# EAGLE design DC26_HHV_challenge (EAGLE 7.7.0)
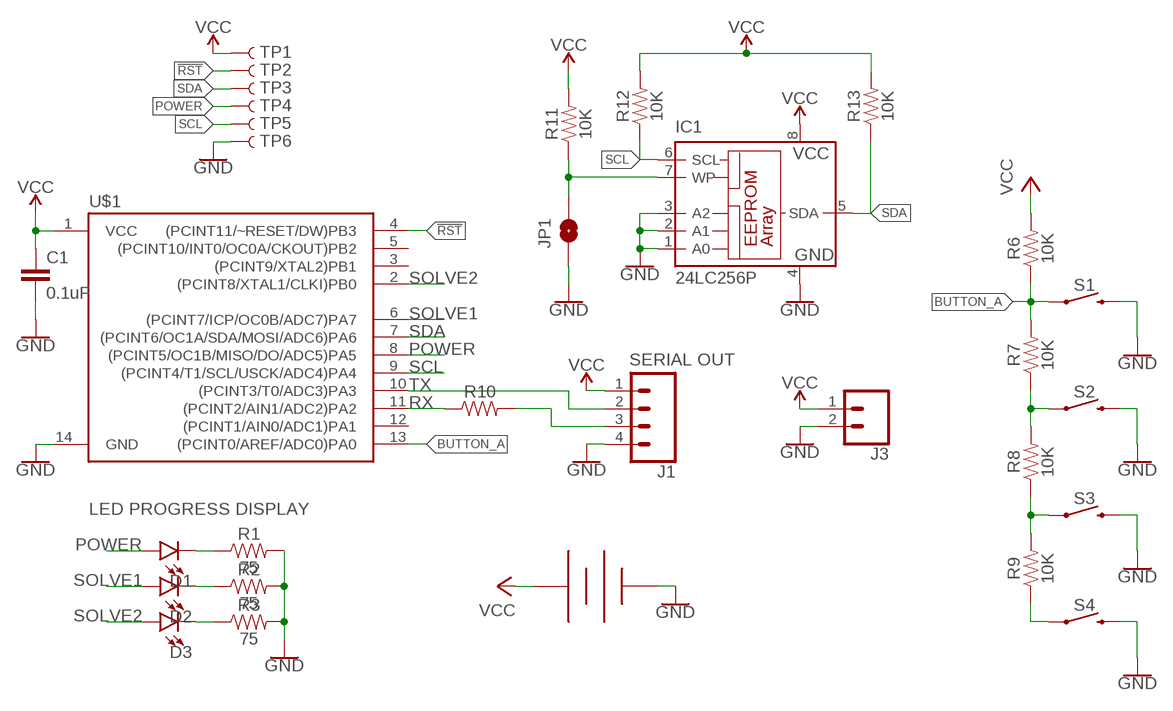
[diagram p0: schematic, sheet 1]

## Parts
BT1  BAT-HLD-001-THM  [BAT-HLD-001-THM]
C1  0.1uF  0.1UF-0603-25V-(+80/-20%)  [0603]
D1  LED5MM  [LED_5MM]
D2  LED5MM  [LED_5MM]
D3  LED5MM  [LED_5MM]
IC1  24LC256P  [DIL8]
J1  CONN_04LOCK  [1X04_LOCK]
J3  CONN_02PTH3  [1X02_LONGPADS]
JP1  JUMPER-SMT_2_NO_SILK  [SMT-JUMPER_2_NO_SILK]
R1  75  RESISTOR0805  [0805]
R2  75  RESISTOR0805  [0805]
R3  75  RESISTOR0805  [0805]
R6  10K  RESISTORAXIAL-0.3  [AXIAL-0.3]
R7  10K  RESISTORAXIAL-0.3  [AXIAL-0.3]
R8  10K  RESISTORAXIAL-0.3  [AXIAL-0.3]
R9  10K  RESISTORAXIAL-0.3  [AXIAL-0.3]
R10  RESISTOR0805  [0805]
R11  10K  RESISTORAXIAL-0.3  [AXIAL-0.3]
R12  10K  RESISTORAXIAL-0.3  [AXIAL-0.3]
R13  10K  RESISTORAXIAL-0.3  [AXIAL-0.3]
S1  MOMENTARY-SWITCH-SPST-PTH-6.0MM  [TACTILE_SWITCH_PTH_6.0MM]
S2  MOMENTARY-SWITCH-SPST-PTH-6.0MM  [TACTILE_SWITCH_PTH_6.0MM]
S3  MOMENTARY-SWITCH-SPST-PTH-6.0MM  [TACTILE_SWITCH_PTH_6.0MM]
S4  MOMENTARY-SWITCH-SPST-PTH-6.0MM  [TACTILE_SWITCH_PTH_6.0MM]
TP1  TEST-POINT3X4  [PAD.03X.04]
TP2  TEST-POINT3X4  [PAD.03X.04]
TP3  TEST-POINT3X4  [PAD.03X.04]
TP4  TEST-POINT3X4  [PAD.03X.04]
TP5  TEST-POINT3X4  [PAD.03X.04]
TP6  TEST-POINT3X4  [PAD.03X.04]
U$1  ATTINY84ATTINY84-20PU  [DIP14]

## Nets
!RST: TP2.P$1 U$1.4((PCINT11/~RESET/DW)PB3)
BUTTON_A: R6.P$1 R7.P$2 S1.1 U$1.13((PCINT0/AREF/ADC0)PA0)
GND: BT1.-(VSS) C1.2 IC1.1(A0) IC1.2(A1) IC1.3(A2) IC1.4(GND) J1.4 J3.2 JP1.1 R1.2 R2.2 R3.2 S1.3 S2.3 S3.3 S4.3 TP6.P$1 U$1.14(GND)
N$1: R9.P$1 S4.1
N$2: R8.P$1 R9.P$2 S3.1
N$3: R7.P$1 R8.P$2 S2.1
N$4: D1.K(C) R1.1
N$5: D2.K(C) R2.1
N$6: D3.K(C) R3.1
N$7: R10.1 U$1.11((PCINT2/AIN1/ADC2)PA2)
N$8: IC1.7(WP) JP1.2 R11.P$1
POWER: D1.A TP4.P$1 U$1.8((PCINT5/OC1B/MISO/DO/ADC5)PA5)
RX: J1.3 R10.2
SCL: IC1.6(SCL) R12.P$1 TP5.P$1 U$1.9((PCINT4/T1/SCL/USCK/ADC4)PA4)
SDA: IC1.5(SDA) R13.P$1 TP3.P$1 U$1.7((PCINT6/OC1A/SDA/MOSI/ADC6)PA6)
SOLVE1: D2.A U$1.6((PCINT7/ICP/OC0B/ADC7)PA7)
SOLVE2: D3.A U$1.2((PCINT8/XTAL1/CLKI)PB0)
TX: J1.2 U$1.10((PCINT3/T0/ADC3)PA3)
VCC: BT1.+@0(VCC) BT1.+@1(VCC) BT1.+@2(VCC) BT1.+@3(VCC) C1.1 IC1.8(VCC) J1.1 J3.1 R6.P$2 R11.P$2 R12.P$2 R13.P$2 TP1.P$1 U$1.1(VCC)
Unconnected: U$1.3((PCINT9/XTAL2)PB1) U$1.5((PCINT10/INT0/OC0A/CKOUT)PB2) U$1.12((PCINT1/AIN0/ADC1)PA1)

## Notes on the sheet
- SERIAL OUT
- LED PROGRESS DISPLAY

## Library data of the parts
BT1 = cuslibrary:BAT-HLD-001-THM
C1 = SparkFun-Capacitors:0.1UF: 0.1µF ceramic capacitors A capacitor is a passive two-terminal electrical component used to store electrical energy temporarily in an electric field.; PROD_ID: CAP-00810
D1-D3 = SparkFun-LED:LED: LED (Generic) Standard schematic elements and footprints for 5mm, 3mm, 1206, and 0603 sized LEDs. Generic LEDs with no color specified.
IC1 = microchip:24*: Serial EEPROM I2C; MF: MICROCHIP; MPN: 24LC256-E/P; OC_FARNELL: 9757970; OC_NEWARK: 92C7169
J1 = SparkFun-Connectors:CONN_04: Multi connection point. Often used as Generic Header-pin footprint for 0.1 inch spaced/style header connections On any of the 0.1 inch spaced packages, you can populate with these: Break Away Headers - Straight <https://www.sparkfun.com/products/116> (PRT-00116) Break Away Male Headers - Right Angle <https://www.sparkfun.com/products/553> (PRT-00553) Female Headers <https://www.sparkfun.com/products/115> (PRT-00115) Break Away Headers - Machine Pin <https://www.sparkfun.com/products/117> (PRT-00117) Break Away Female Headers - Swiss Machine Pin <https://www.sparkfun.com/products/743> (PRT-00743) For SCREWTERMINALS and SPRING TERMINALS visit here: Screw Terimnals on SparkFun.com <https://www.sparkfun.com/search/results?term=Screw+Terminals> (5mm/3.5mm/2.54mm spacing) This device is also useful as a general connection point to wire up your design to another part of your project. Our various solder wires solder well into these plated through hole pads. Hook-Up Wire - Assortment (Stranded, 22 AWG) <https://www.sparkfun.com/products/11375> (PRT-11375) Hook-Up Wire - Assortment (Solid Core, 22 AWG) <https://www.sparkfun.com/products/11367> (PRT-11367) View the entire wire category on our website here <https://www.sparkfun.com/categories/141> Special notes: Molex polarized connector foot print use with SKU : PRT-08231 with associated crimp pins and housings. 1MM SMD Version SKU: PRT-10208; PROD_ID: CONN-09696
J3 = SparkFun-Connectors:CONN_02: Multi connection point. Often used as Generic Header-pin footprint for 0.1 inch spaced/style header connections On any of the 0.1 inch spaced packages, you can populate with these: Break Away Headers - Straight <https://www.sparkfun.com/products/116> (PRT-00116) Break Away Male Headers - Right Angle <https://www.sparkfun.com/products/553> (PRT-00553) Female Headers <https://www.sparkfun.com/products/115> (PRT-00115) Break Away Headers - Machine Pin <https://www.sparkfun.com/products/117> (PRT-00117) Break Away Female Headers - Swiss Machine Pin <https://www.sparkfun.com/products/743> (PRT-00743) For SCREWTERMINALS and SPRING TERMINALS visit here: Screw Terimnals on SparkFun.com <https://www.sparkfun.com/search/results?term=Screw+Terminals> (5mm/3.5mm/2.54mm spacing) This device is also useful as a general connection point to wire up your design to another part of your project. Our various solder wires solder well into these plated through hole pads. Hook-Up Wire - Assortment (Stranded, 22 AWG) <https://www.sparkfun.com/products/11375> (PRT-11375) Hook-Up Wire - Assortment (Solid Core, 22 AWG) <https://www.sparkfun.com/products/11367> (PRT-11367) View the entire wire category on our website here <https://www.sparkfun.com/categories/141> Special notes: Molex polarized connector foot print use with: PRT-08233 with associated crimp pins and housings. 2.54_SCREWTERM for use with PRT-10571. 3.5mm Screw Terminal footprints for PRT-08084 5mm Screw Terminal footprints for use with PRT-08432
JP1 = SparkFun-Jumpers:JUMPER-SMT_2_NO: Normally open jumper This jumper has two pads in close proximity to each other. Apply solder to close the connection. Round pads are easier to solder for beginners, but are a lot larger. SparkFun Product that uses the round pads: SparkFun EL Sequencer <https://www.sparkfun.com/products/12781>
R1-R3 R6-R13 = SparkFun-Resistors:RESISTOR: Generic Resistor Package
S1-S4 = SparkFun-Switches:MOMENTARY-SWITCH-SPST: Momentary Switch (Pushbutton) - SPST Normally-open (NO) SPST momentary switches (buttons, pushbuttons). Variants PTH-12MM - 12mm square, through-hole Momentary Pushbutton Switch - 12mm Square <https://www.sparkfun.com/products/9190> (COM-09190) PTH-6.0MM, PTH-6.0MM-KIT - 6.0mm square, through-hole Mini Pushbutton Switch <https://www.sparkfun.com/products/97> (COM-00097) KIT package intended for soldering kit's - only one side of pads' copper is exposed. PTH-RIGHT-ANGLE-KIT - Right-angle, through-hole Right Angle Tactile Button <https://www.sparkfun.com/products/10791> - Used on SparkFun BigTime Watch Kit <https://www.sparkfun.com/products/11734> SMD-12MM - 12mm square, surface-mount Tactile Button - SMD (12mm) <https://www.sparkfun.com/products/12993> (COM-12993) Used on SparkFun PicoBoard <https://www.sparkfun.com/products/11888> SMD-4.5MM - 4.5mm Square Trackball Switch Used on SparkFun Blackberry Trackballer Breakout <https://www.sparkfun.com/products/13169> SMD-4.6MMX2.8MM - 4.60mm x 2.80mm, surface mount Used on SparkFun SAMD21 Mini Breakout <https://www.sparkfun.com/products/13664> SMD-5.2MM, SMD-5.2-REDUNDANT - 5.2mm square, surface-mount Mini Pushbutton Switch - SMD <https://www.sparkfun.com/products/8720> (COM-08720) Used on Arduino Pro Mini <https://www.sparkfun.com/products/11114> REDUNDANT package connects both switch circuits together SMD-6.0X3.5MM - 6.0 x 3.5mm, surface mount Momentary Reset Switch SMD <https://www.sparkfun.com/products/8229> (COM-08229) SMD-6.2MM-TALL - 6.2mm square, surface mount Tactile Button - SMD (6mm) <https://www.sparkfun.com/products/12992> Used on SparkFun Digital Sandbox <https://www.sparkfun.com/products/12651> SMD-RIGHT-ANGLE - Right-angle, surface mount Used on SparkFun Block for Intel® Edison - Arduino <https://www.sparkfun.com/products/13036>; PROD_ID: SWCH-08441; SF_SKU: COM-00097
TP1-TP6 = SparkFun-Connectors:TEST-POINT: SparkFun Test Points Bare copper test points for troubleshooting or In-Circuit-Testing. These are used by our Production team for verifying production board runs using pogo-pins on test beds. SparkFun Products: SparkFun LSM9DS1 Breakout <https://www.sparkfun.com/products/13284> SparkFun PSOC <https://www.sparkfun.com/products/13714> SparkFun Load Cell Amplifier <https://www.sparkfun.com/products/13879>
U$1 = SparkFun-IC-Microcontroller:ATTINY84: Atmel 14-pin 2/4/8kB flash uC Datasheet <https://cdn.sparkfun.com/datasheets/Widgets/doc8006.pdf> SparkFun Products Tiny AVR Programmer <https://www.sparkfun.com/products/11801> (PGM-11801) SparkFun Servo Trigger - Continuous Rotation <https://www.sparkfun.com/products/13872> (WIG-13872) SparkFun Servo Trigger <https://www.sparkfun.com/products/13118> (WIG-13118)

## Board
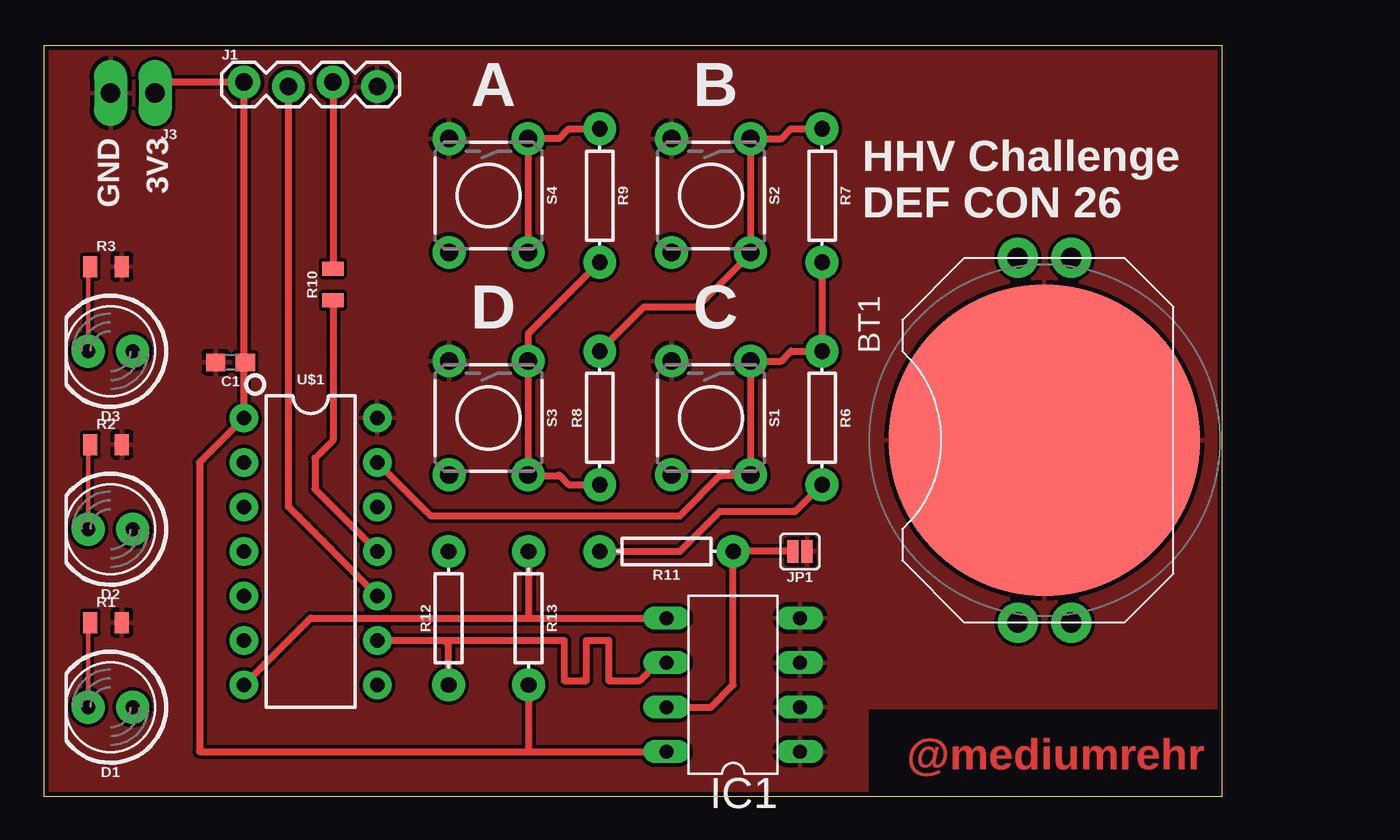
[diagram p1: board, top side]
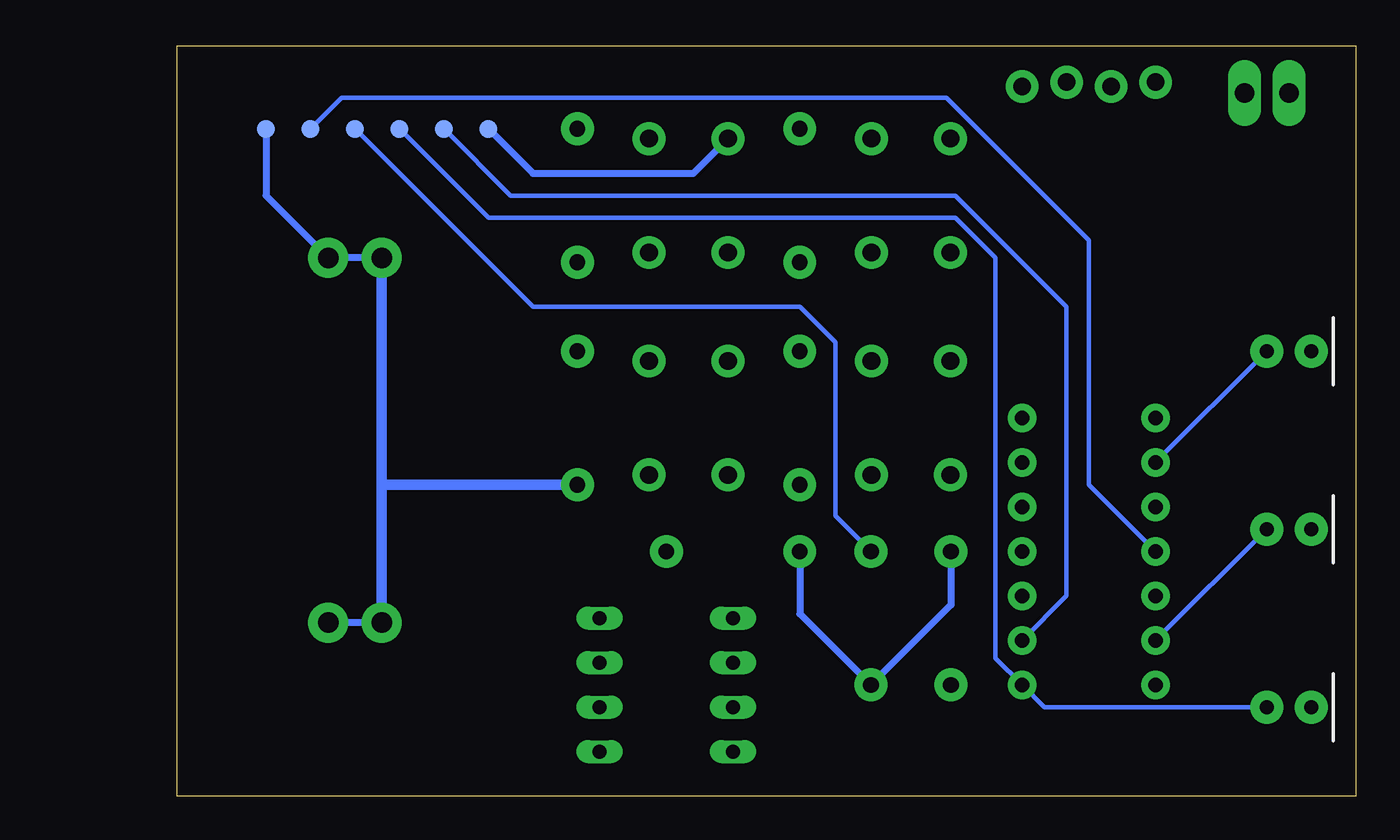
[diagram p2: board, bottom side, seen from below]

Size 67.29 x 42.85 mm. Coordinates in mm from the lower left corner, seen from the top.
Outline: 0,0 67.29,0 67.29,42.85 0,42.85 0,0
Copper layers (1*16): Top 0.035mm / dielectric 1.5mm / Bottom 0.035mm
Design rules "default *": minimum track width 6mil, minimum drill 12mil, track to track 8mil, track to pad 8mil, pad to pad 8mil, via to via 8mil, smd to smd 8mil, copper to edge 10mil, drill to drill 8mil, minimum pad ring 10mil, minimum via ring 8mil, stop-mask expansion 10mil, vias tented up to drill 0mil, thermal gap 10mil

### Footprints (pad centres in the part's own frame; a part is rotated, then mirrored left to right if it is on the bottom)
BAT-HLD-001-THM = drill 1.168 pad 2.286: +@0 -10.414,1.524; +@1 -10.414,-1.524; +@2 10.414,1.524; +@3 10.414,-1.524 | smd 17.78 x 17.78: - 0,0
0603 = smd 1.1 x 1: 1 -0.85,0; 2 0.85,0
LED_5MM = drill 0.813 pad 1.88: A -1.27,0; K 1.27,0
DIL8 = drill 0.813 long: 1 -3.81,-3.81; 2 -1.27,-3.81; 3 1.27,-3.81; 4 3.81,-3.81; 5 3.81,3.81; 6 1.27,3.81; 7 -1.27,3.81; 8 -3.81,3.81
1X04_LOCK = drill 1.016 pad 1.88: 1 0,0.127; 2 2.54,-0.127; 3 5.08,0.127; 4 7.62,-0.127
1X02_LONGPADS = drill 1.118 pad 1.88 long: 1 0,0; 2 2.54,0
SMT-JUMPER_2_NO_SILK = smd 0.635 x 1.27: 1 -0.406,0; 2 0.406,0
0805 = smd 0.8 x 1.2: 1 -0.9,0; 2 0.9,0
AXIAL-0.3 = drill 0.9 pad 1.88: P$1 -3.81,0; P$2 3.81,0
TACTILE_SWITCH_PTH_6.0MM = drill 1.016 pad 1.88: 1 -3.251,2.261; 2 3.251,2.261; 3 -3.251,-2.261; 4 3.251,-2.261
PAD.03X.04 = smd 1.016 x 1.016: P$1 0,0
DIP14 = drill 0.813 pad 1.626: 1 -7.62,-3.81; 2 -5.08,-3.81; 3 -2.54,-3.81; 4 0,-3.81; 5 2.54,-3.81; 6 5.08,-3.81; 7 7.62,-3.81; 8 7.62,3.81; 9 5.08,3.81; 10 2.54,3.81; 11 0,3.81; 12 -2.54,3.81; 13 -5.08,3.81; 14 -7.62,3.81

### Placement (x,y rotation side)
BT1  57.15,20.32 270 top
C1  10.67,24.77 180 top
D1  3.81,5.08 180 top
D2  3.81,15.24 180 top
D3  3.81,25.4 180 top
IC1  39.37,6.35 90 top
J1  11.43,40.64 0 top
J3  6.35,40.13 180 top
JP1  43.18,13.97 180 top
R1  3.56,9.91 0 top
R2  3.56,20.07 0 top
R3  3.56,30.23 0 top
R6  44.45,21.59 270 top
R7  44.45,34.29 270 top
R8  31.75,21.59 90 top
R9  31.75,34.29 270 top
R10  16.51,29.21 90 top
R11  35.56,13.97 180 top
R12  23.11,10.16 90 top
R13  27.69,10.16 270 top
S1  38.1,21.59 270 top
S2  38.1,34.29 270 top
S3  25.4,21.59 270 top
S4  25.4,34.29 270 top
TP1  62.23,38.1 90 bottom
TP2  59.69,38.1 90 bottom
TP3  57.15,38.1 90 bottom
TP4  54.61,38.1 90 bottom
TP5  52.07,38.1 90 bottom
TP6  49.53,38.1 90 bottom
U$1  15.24,13.97 270 top

### Tracks (layer width: path | path; a pad name or v marks a point on that pad's centre or on a via)
!RST
  Bottom 0.254: TP2.P$1 57.91,39.88 23.37,39.88 15.24,31.75 15.24,17.78 U$1.4
BUTTON_A
  Top 0.406: R7.P$2 R6.P$1 42.67,25.4 42.11,24.84 S1.1 40.36,18.31 40.39,18.29 38.71,18.29 38.66,18.34 36.32,16 22.1,16 U$1.13
GND
  Bottom 0.406: TP6.P$1 46.99,35.56 37.82,35.56 S2.3
  pour Top: 0,43.18 0,0 46.99,0 46.99,5.08 68.58,5.08 68.58,43.18
N$1
  Top 0.406: R9.P$1 29.97,38.1 29.41,37.54 S4.1 27.66,37.57 27.69,37.59 27.69,30.99
N$2
  Top 0.406: R9.P$2 27.66,26.39 S3.1 27.66,18.31 27.69,18.29 29.36,18.29 29.41,18.34 29.97,17.78 R8.P$1
N$3
  Top 0.406: R8.P$2 34.29,27.94 37.34,27.94 40.39,30.99 40.39,37.52 S2.1 42.11,37.54 42.67,38.1 R7.P$1
N$4
  Top 0.254: D1.K 2.54,9.79
  Top 0.406: 2.54,9.79 R1.1
N$5
  Top 0.254: D2.K 2.54,19.95
  Top 0.406: 2.54,19.95 R2.1
N$6
  Top 0.254: D3.K 2.54,30.11
  Top 0.406: 2.54,30.11 R3.1
N$7
  Top 0.406: R10.1 16.51,20.32 15.49,19.3 15.49,17.53 U$1.11
N$8
  Top 0.406: IC1.7 38.1,5.08 39.37,6.35 R11.P$1 JP1.2
POWER
  Bottom 0.254: D1.A 17.78,5.08 U$1.8 20.57,7.87 20.57,30.73 22.86,33.02 49.53,33.02 TP4.P$1
RX
  Top 0.406: J1.3 R10.2
SCL
  Top 0.406: U$1.9 22.86,8.89 | 22.86,8.89 29.72,8.89 29.72,6.6 30.99,6.6 30.99,8.89 32.26,8.89 32.26,6.6 34.04,6.6 35.05,7.62 IC1.6 | R12.P$1 23.11,8.64 22.86,8.89
  Bottom 0.254: TP5.P$1 48.26,34.29 22.86,34.29 16.51,27.94 16.51,11.43 U$1.9
SDA
  Top 0.406: U$1.7 15.24,10.16 27.69,10.16 | R13.P$1 27.69,10.16 | 27.69,10.16 IC1.5
  Bottom 0.254: TP3.P$1 46.99,27.94 31.75,27.94 29.72,25.91 29.72,16 R13.P$1
SOLVE1
  Bottom 0.254: D2.A U$1.6
SOLVE2
  Bottom 0.254: D3.A U$1.2
TX
  Top 0.406: U$1.10 13.97,16.51 J1.2
VCC
  Top 0.406: 11.43,24.77 U$1.1 8.89,19.05 8.89,2.54 27.69,2.54 | 11.43,24.77 J1.1 6.35,40.77 J3.1 | C1.1 11.43,24.77 | 27.69,2.54 IC1.8 | R13.P$2 27.69,2.54 | R11.P$2 36.32,13.97 38.61,16.26 42.93,16.26 R6.P$2
  Bottom 0.406: R11.P$2 31.75,10.41 R13.P$2 23.11,10.92 R12.P$2 | BT1.+@1 BT1.+@0 62.23,34.29 TP1.P$1 | BT1.+@3 BT1.+@2
  Bottom 0.61: BT1.+@3 55.63,17.78 | 55.63,17.78 BT1.+@1 | R6.P$2 55.63,17.78

### Text on the board
Top: @mediumrehr
tPlace: A | B | GND | 3V3 | HHV Challenge / DEF CON 26 | D | C